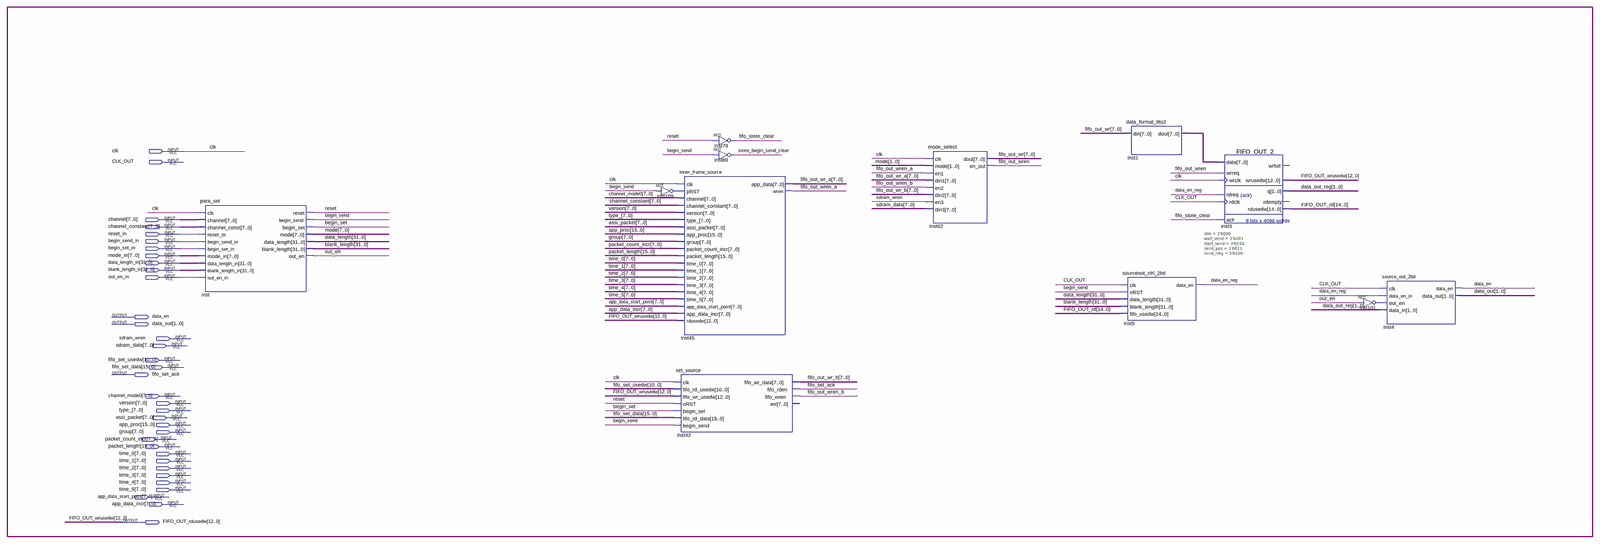
[diagram p0: schematic sheet, whole]
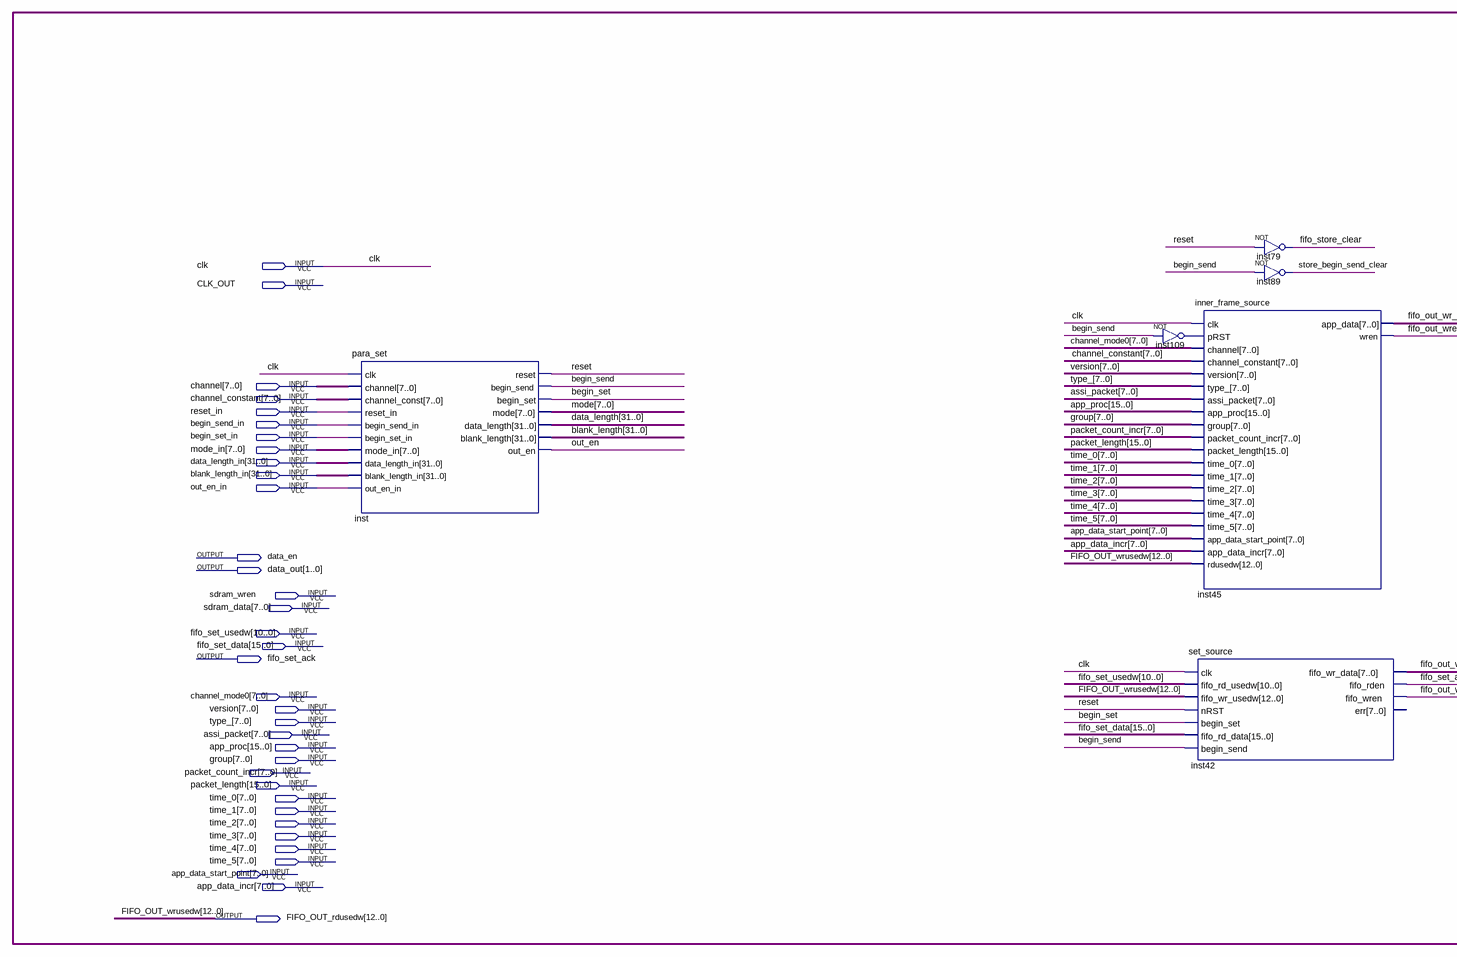
[diagram p1: schematic sheet, left part]
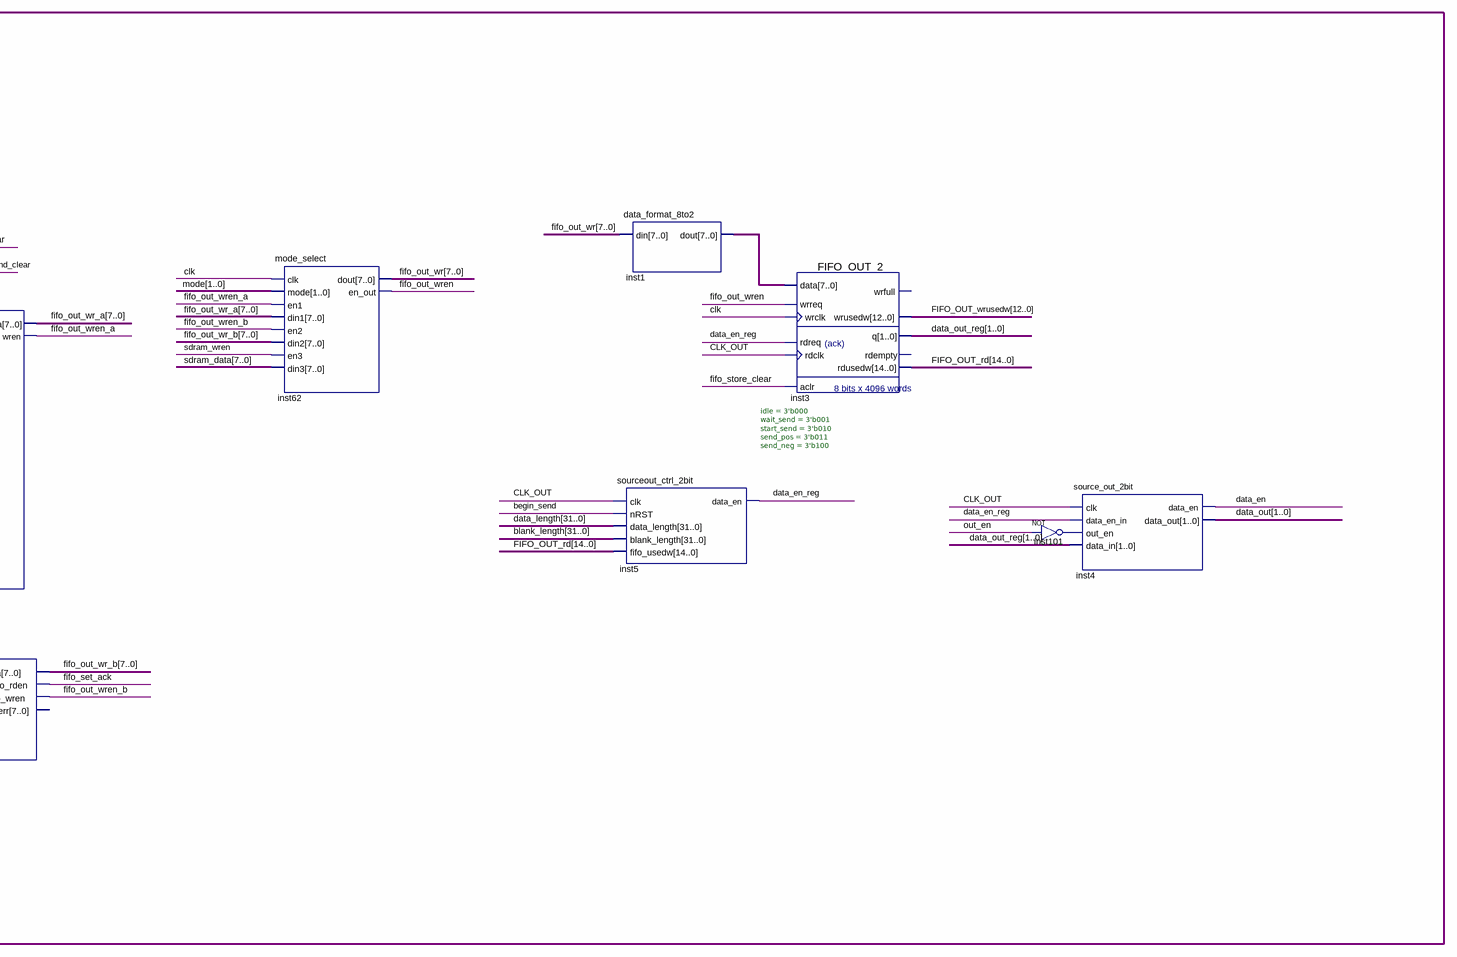
[diagram p2: schematic sheet, right part]
// Quartus schematic data_source_blk_2bit.bdf as structural Verilog: 12 symbols, 35 pins
module data_source_blk_2bit (
  input  clk,
  input  CLK_OUT,
  input  [7:0] channel,
  input  [7:0] channel_constant,
  input  reset_in,
  input  begin_send_in,
  input  begin_set_in,
  input  [7:0] mode_in,
  input  [31:0] data_length_in,
  input  [31:0] blank_length_in,
  input  out_en_in,
  input  sdram_wren,
  input  [7:0] sdram_data,
  input  [10:0] fifo_set_usedw,
  input  [15:0] fifo_set_data,
  input  [7:0] channel_mode0,
  input  [7:0] version,
  input  [7:0] type_,
  input  [7:0] assi_packet,
  input  [15:0] app_proc,
  input  [7:0] group,
  input  [7:0] packet_count_incr,
  input  [15:0] packet_length,
  input  [7:0] time_0,
  input  [7:0] time_1,
  input  [7:0] time_2,
  input  [7:0] time_3,
  input  [7:0] time_4,
  input  [7:0] time_5,
  input  [7:0] app_data_start_point,
  input  [7:0] app_data_incr,
  output data_en,
  output [1:0] data_out,
  output fifo_set_ack,
  output [12:0] FIFO_OUT_rdusedw
);

  wire begin_send, begin_set, data_en_reg, fifo_out_wren, fifo_out_wren_a, fifo_out_wren_b, fifo_store_clear,
       inst101_out, inst109_out, out_en, reset, store_begin_send_clear;
  wire [1:0] data_out_reg;
  wire [7:0] fifo_out_wr, fifo_out_wr_a, fifo_out_wr_b, inst1_dout, mode;
  wire [14:0] FIFO_OUT_rd;
  wire [31:0] blank_length, data_length;

  para_set inst (
    .clk(clk), .channel(channel), .channel_const(channel_constant), .reset_in(reset_in),
    .begin_send_in(begin_send_in), .begin_set_in(begin_set_in), .mode_in(mode_in),
    .data_length_in(data_length_in), .blank_length_in(blank_length_in), .out_en_in(out_en_in), .reset(reset),
    .begin_send(begin_send), .begin_set(begin_set), .mode(mode), .data_length(data_length),
    .blank_length(blank_length), .out_en(out_en));
  not inst109 (inst109_out, begin_send);
  inner_frame_source inst45 (
    .clk(clk), .pRST(inst109_out), .channel(channel_mode0), .channel_constant(channel_constant),
    .version(version), .type_(type_), .assi_packet(assi_packet), .app_proc(app_proc), .group(group),
    .packet_count_incr(packet_count_incr), .packet_length(packet_length), .time_0(time_0), .time_1(time_1),
    .time_2(time_2), .time_3(time_3), .time_4(time_4), .time_5(time_5),
    .app_data_start_point(app_data_start_point), .app_data_incr(app_data_incr), .rdusedw(FIFO_OUT_rdusedw),
    .app_data(fifo_out_wr_a), .wren(fifo_out_wren_a));
  set_source inst42 (
    .clk(clk), .fifo_rd_usedw(fifo_set_usedw), .fifo_wr_usedw(FIFO_OUT_rdusedw), .nRST(reset),
    .begin_set(begin_set), .fifo_rd_data(fifo_set_data), .begin_send(begin_send),
    .fifo_wr_data(fifo_out_wr_b), .fifo_rden(fifo_set_ack), .fifo_wren(fifo_out_wren_b));  // open: err
  not inst79 (fifo_store_clear, reset);
  not inst89 (store_begin_send_clear, begin_send);
  mode_select inst62 (
    .clk(clk), .mode(mode[1:0]), .en1(fifo_out_wren_a), .din1(fifo_out_wr_a), .en2(fifo_out_wren_b),
    .din2(fifo_out_wr_b), .en3(sdram_wren), .din3(sdram_data), .dout(fifo_out_wr), .en_out(fifo_out_wren));
  data_format_8to2 inst1 (.din(fifo_out_wr), .dout(inst1_dout));
  sourceout_ctrl_2bit #(.idle(3'b000), .wait_send(3'b001), .start_send(3'b010), .send_pos(3'b011), .send_neg(3'b100)) inst5 (
    .clk(CLK_OUT), .nRST(begin_send), .data_length(data_length), .blank_length(blank_length),
    .fifo_usedw(FIFO_OUT_rd), .data_en(data_en_reg));
  FIFO_OUT_2 inst3 (
    .data(inst1_dout), .wrreq(fifo_out_wren), .wrclk(clk), .rdreq(data_en_reg), .rdclk(CLK_OUT),
    .aclr(fifo_store_clear), .wrusedw(FIFO_OUT_rdusedw), .q(data_out_reg), .rdusedw(FIFO_OUT_rd));  // open: wrfull, rdempty
  not inst101 (inst101_out, out_en);
  source_out_2bit inst4 (
    .clk(CLK_OUT), .data_en_in(data_en_reg), .out_en(inst101_out), .data_in(data_out_reg), .data_en(data_en),
    .data_out(data_out));

  // Other names for the same wires on the sheet: FIFO_OUT_wrusedw[12:0] = FIFO_OUT_rdusedw
endmodule
